# Altium schematic sheet RS232.SchDoc
size C; DocumentNumber: 2; SheetNumber: 2; SheetTotal: 2
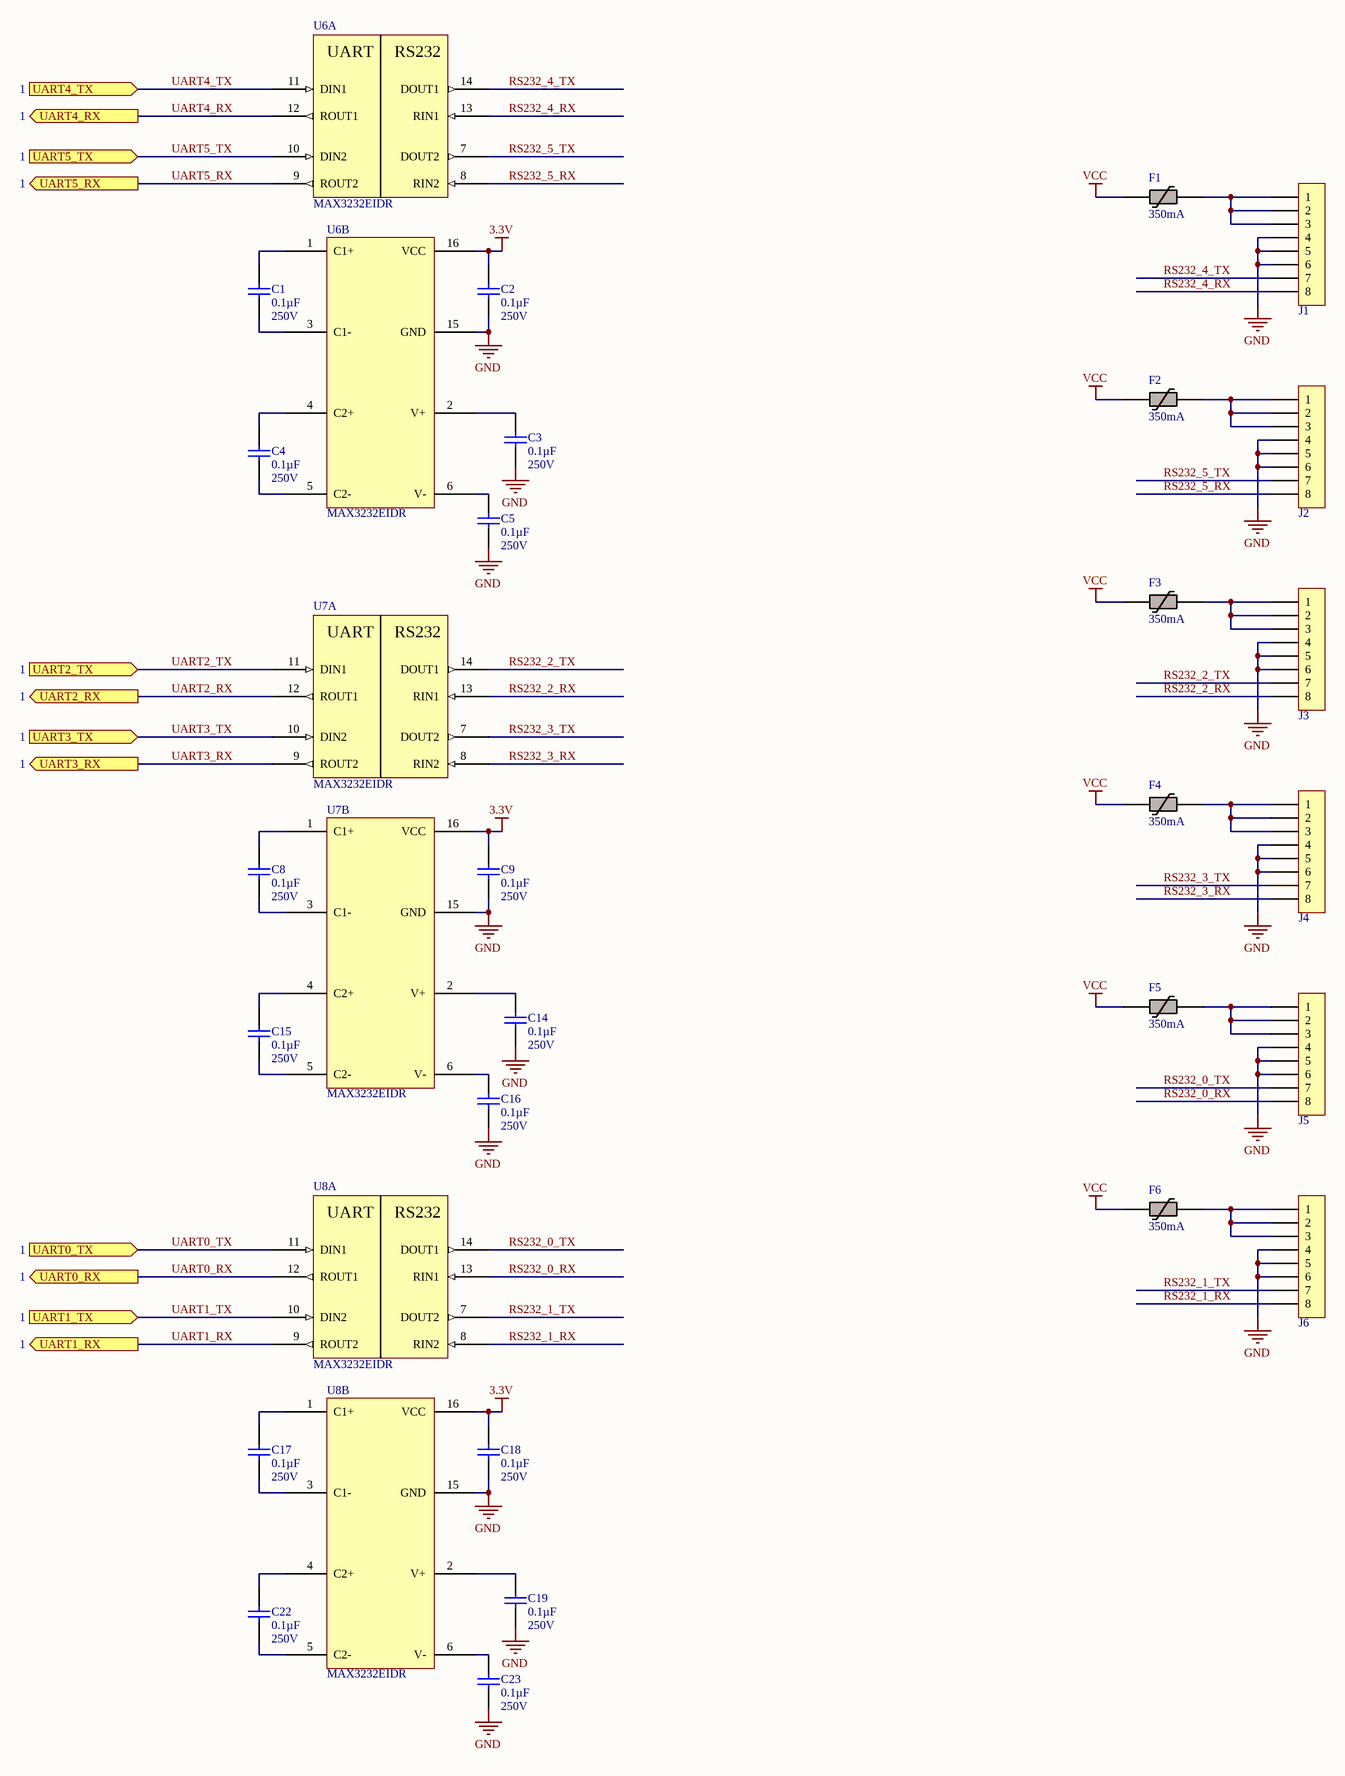
[diagram p0: RS232.SchDoc]

## Parts
C1  0.1µF  Voltage: 250V  [Chip0805]
C2  0.1µF  Voltage: 250V  [Chip0805]
C3  0.1µF  Voltage: 250V  [Chip0805]
C4  0.1µF  Voltage: 250V  [Chip0805]
C5  0.1µF  Voltage: 250V  [Chip0805]
C8  0.1µF  Voltage: 250V  [Chip0805]
C9  0.1µF  Voltage: 250V  [Chip0805]
C14  0.1µF  Voltage: 250V  [Chip0805]
C15  0.1µF  Voltage: 250V  [Chip0805]
C16  0.1µF  Voltage: 250V  [Chip0805]
C17  0.1µF  Voltage: 250V  [Chip0805]
C18  0.1µF  Voltage: 250V  [Chip0805]
C19  0.1µF  Voltage: 250V  [Chip0805]
C22  0.1µF  Voltage: 250V  [Chip0805]
C23  0.1µF  Voltage: 250V  [Chip0805]
F1  350mA  [Chip1812]
F2  350mA  [Chip1812]
F3  350mA  [Chip1812]
F4  350mA  [Chip1812]
F5  350mA  [Chip1812]
F6  350mA  [Chip1812]
J1  949  [KEYSTONE_949]  (value not drawn)
J2  949  [KEYSTONE_949]  (value not drawn)
J3  949  [KEYSTONE_949]  (value not drawn)
J4  949  [KEYSTONE_949]  (value not drawn)
J5  949  [KEYSTONE_949]  (value not drawn)
J6  949  [KEYSTONE_949]  (value not drawn)
U6  MAX3232EIDR  [16-SOIC]  (parts A,B of 2)
U7  MAX3232EIDR  [16-SOIC]  (parts A,B of 2)
U8  MAX3232EIDR  [16-SOIC]  (parts A,B of 2)

## Ports
UART0_RX (out, see 1), UART0_TX (in, see 1), UART1_RX (out, see 1), UART1_TX (in, see 1), UART2_RX (out, see 1), UART2_TX (in, see 1), UART3_RX (out, see 1), UART3_TX (in, see 1), UART4_RX (out, see 1), UART4_TX (in, see 1), UART5_RX (out, see 1), UART5_TX (in, see 1)

## Nets
3.3V: C2.2 C9.2 C18.2 U6.16(VCC) U7.16(VCC) U8.16(VCC)
GND: C2.1 C3.1 C5.1 C9.1 C14.1 C16.1 C18.1 C19.1 C23.1 J1.4 J1.5 J1.6 J2.4 J2.5 J2.6 J3.4 J3.5 J3.6 J4.4 J4.5 J4.6 J5.4 J5.5 J5.6 J6.4 J6.5 J6.6 U6.15(GND) U7.15(GND) U8.15(GND)
VCC: F1.1 F2.1 F3.1 F4.1 F5.1 F6.1
RS232_0_RX: J5.8 U8.13(RIN1)
RS232_0_TX: J5.7 U8.14(DOUT1)
RS232_1_RX: J6.8 U8.8(RIN2)
RS232_1_TX: J6.7 U8.7(DOUT2)
RS232_2_RX: J3.8 U7.13(RIN1)
RS232_2_TX: J3.7 U7.14(DOUT1)
RS232_3_RX: J4.8 U7.8(RIN2)
RS232_3_TX: J4.7 U7.7(DOUT2)
RS232_4_RX: J1.8 U6.13(RIN1)
RS232_4_TX: J1.7 U6.14(DOUT1)
RS232_5_RX: J2.8 U6.8(RIN2)
RS232_5_TX: J2.7 U6.7(DOUT2)
UART0_RX: U8.12(ROUT1) ; port UART0_RX
UART0_TX: U8.11(DIN1) ; port UART0_TX
UART1_RX: U8.9(ROUT2) ; port UART1_RX
UART1_TX: U8.10(DIN2) ; port UART1_TX
UART2_RX: U7.12(ROUT1) ; port UART2_RX
UART2_TX: U7.11(DIN1) ; port UART2_TX
UART3_RX: U7.9(ROUT2) ; port UART3_RX
UART3_TX: U7.10(DIN2) ; port UART3_TX
UART4_RX: U6.12(ROUT1) ; port UART4_RX
UART4_TX: U6.11(DIN1) ; port UART4_TX
UART5_RX: U6.9(ROUT2) ; port UART5_RX
UART5_TX: U6.10(DIN2) ; port UART5_TX
NetC1_1: C1.1 U6.3(C1-)
NetC1_2: C1.2 U6.1(C1+)
NetC3_2: C3.2 U6.2(V+)
NetC4_1: C4.1 U6.5(C2-)
NetC4_2: C4.2 U6.4(C2+)
NetC5_2: C5.2 U6.6(V-)
NetC8_1: C8.1 U7.3(C1-)
NetC8_2: C8.2 U7.1(C1+)
NetC14_2: C14.2 U7.2(V+)
NetC15_1: C15.1 U7.5(C2-)
NetC15_2: C15.2 U7.4(C2+)
NetC16_2: C16.2 U7.6(V-)
NetC17_1: C17.1 U8.3(C1-)
NetC17_2: C17.2 U8.1(C1+)
NetC19_2: C19.2 U8.2(V+)
NetC22_1: C22.1 U8.5(C2-)
NetC22_2: C22.2 U8.4(C2+)
NetC23_2: C23.2 U8.6(V-)
NetF1_2: F1.2 J1.1 J1.2 J1.3
NetF2_2: F2.2 J2.1 J2.2 J2.3
NetF3_2: F3.2 J3.1 J3.2 J3.3
NetF4_2: F4.2 J4.1 J4.2 J4.3
NetF5_2: F5.2 J5.1 J5.2 J5.3
NetF6_2: F6.2 J6.1 J6.2 J6.3

## Notes on the sheet
- Title:
- This work is licensed under a Creative Commons Attribution 4.0 International License. Derivative works should remove all Sophistry branding and ‘é’ watermark.
- Date:
- Engineer:
- Revision:
- Codename:
- Time:
- Variant:
- Sheet
- of
- (in symbol MAX3232EIDR, part A) UART; RS232

## Library data of the parts
C1-C5 C8 C9 C14-C19 C22 C23 = C2012X7T2E104K125AA: CAP CER 0.1UF 250V 10% X7T 0805; Manufacturer: TDK Corporation; PartNumber: C2012X7T2E104K125AA; HelpURL: http://product.tdk.com/capacitor/mlcc/en/documents/mlcc_commercial_midvoltage_en.pdf; Supplier 1: Digi-Key; Supplier Part Number 1: 445-7749-1-ND; Supplier 2: Mouser; Manufacturer Part Number: C2012X7T2E104K125AA; Series: C; Capacitance: 0.1µF; Tolerance: ±10%; Temperature Coefficient: X7T; Mounting Type: Surface Mount, MLCC; Operating Temperature: -55°C ~ 125°C; Applications: General Purpose; Ratings: -; Package / Case: 0805 (2012 Metric); Size / Dimension: 0.079" L x 0.049" W (2.00mm x 1.25mm); Height - Seated (Max): -; Thickness (Max): 0.057" (1.45mm); Lead Spacing: -; Features: -; Lead Style: -
F1-F6 = 0ZCG0035AF2C: PTC RESET FUSE 30V 350MA 1812; Manufacturer: Bel Fuse Inc.; PartNumber: 0ZCG0035AF2C; HelpURL: https://www.belfuse.com/resources/datasheets/circuitprotection/ds-cp-0zcg-series.pdf; Supplier 1: Digi-Key; Supplier Part Number 1: 507-1760-1-ND; Supplier 2: Mouser; Supplier Part Number 2: 530-0ZCG0035AF2C; Supplier 3: LCSC; Supplier Part Number 3: C3762402; Manufacturer Part Number: 0ZCG0035AF2C; Current_Hold: 350mA
J1-J6 = 949: CONN MOD JACK 8P8C VERT UNSHLD; Manufacturer: Keystone Electronics; PartNumber: 949; HelpURL: https://www.keyelco.com/product-pdf.cfm?p=14078; Supplier 1: Digi-Key; Supplier Part Number 1: 36-949-ND; Supplier 2: Mouser; Supplier Part Number 2: 534-949; Manufacturer Part Number: 949
U6-U8 = MAX3232EIDR: IC TRANSCEIVER FULL 2/2 16SOIC; Manufacturer: Texas Instruments; PartNumber: MAX3232EIDR; Supplier 1: Digi-Key; Supplier 2: Mouser; Supplier Part Number 2: 595-MAX3232EIDR; HelpURL: https://www.ti.com/lit/ds/symlink/max3232e.pdf?HQS=dis-dk-null-digikeymode-dsf-pf-null-wwe&ts=1710373009473&ref_url=https%253A%252F%252Fwww.ti.com%252Fgeneral%252Fdocs%252Fsuppproductinfo.tsp%253FdistId%253D10%2526gotoUrl%253Dhttps%253A%252F%252Fwww.ti.com%252Flit%252Fgpn%252Fmax3232e; Supplier Part Number 1: 296-19752-1-ND; Manufacturer Part Number: MAX3232EIDR